# EAGLE schematic base1 (EAGLE 7.2.0)
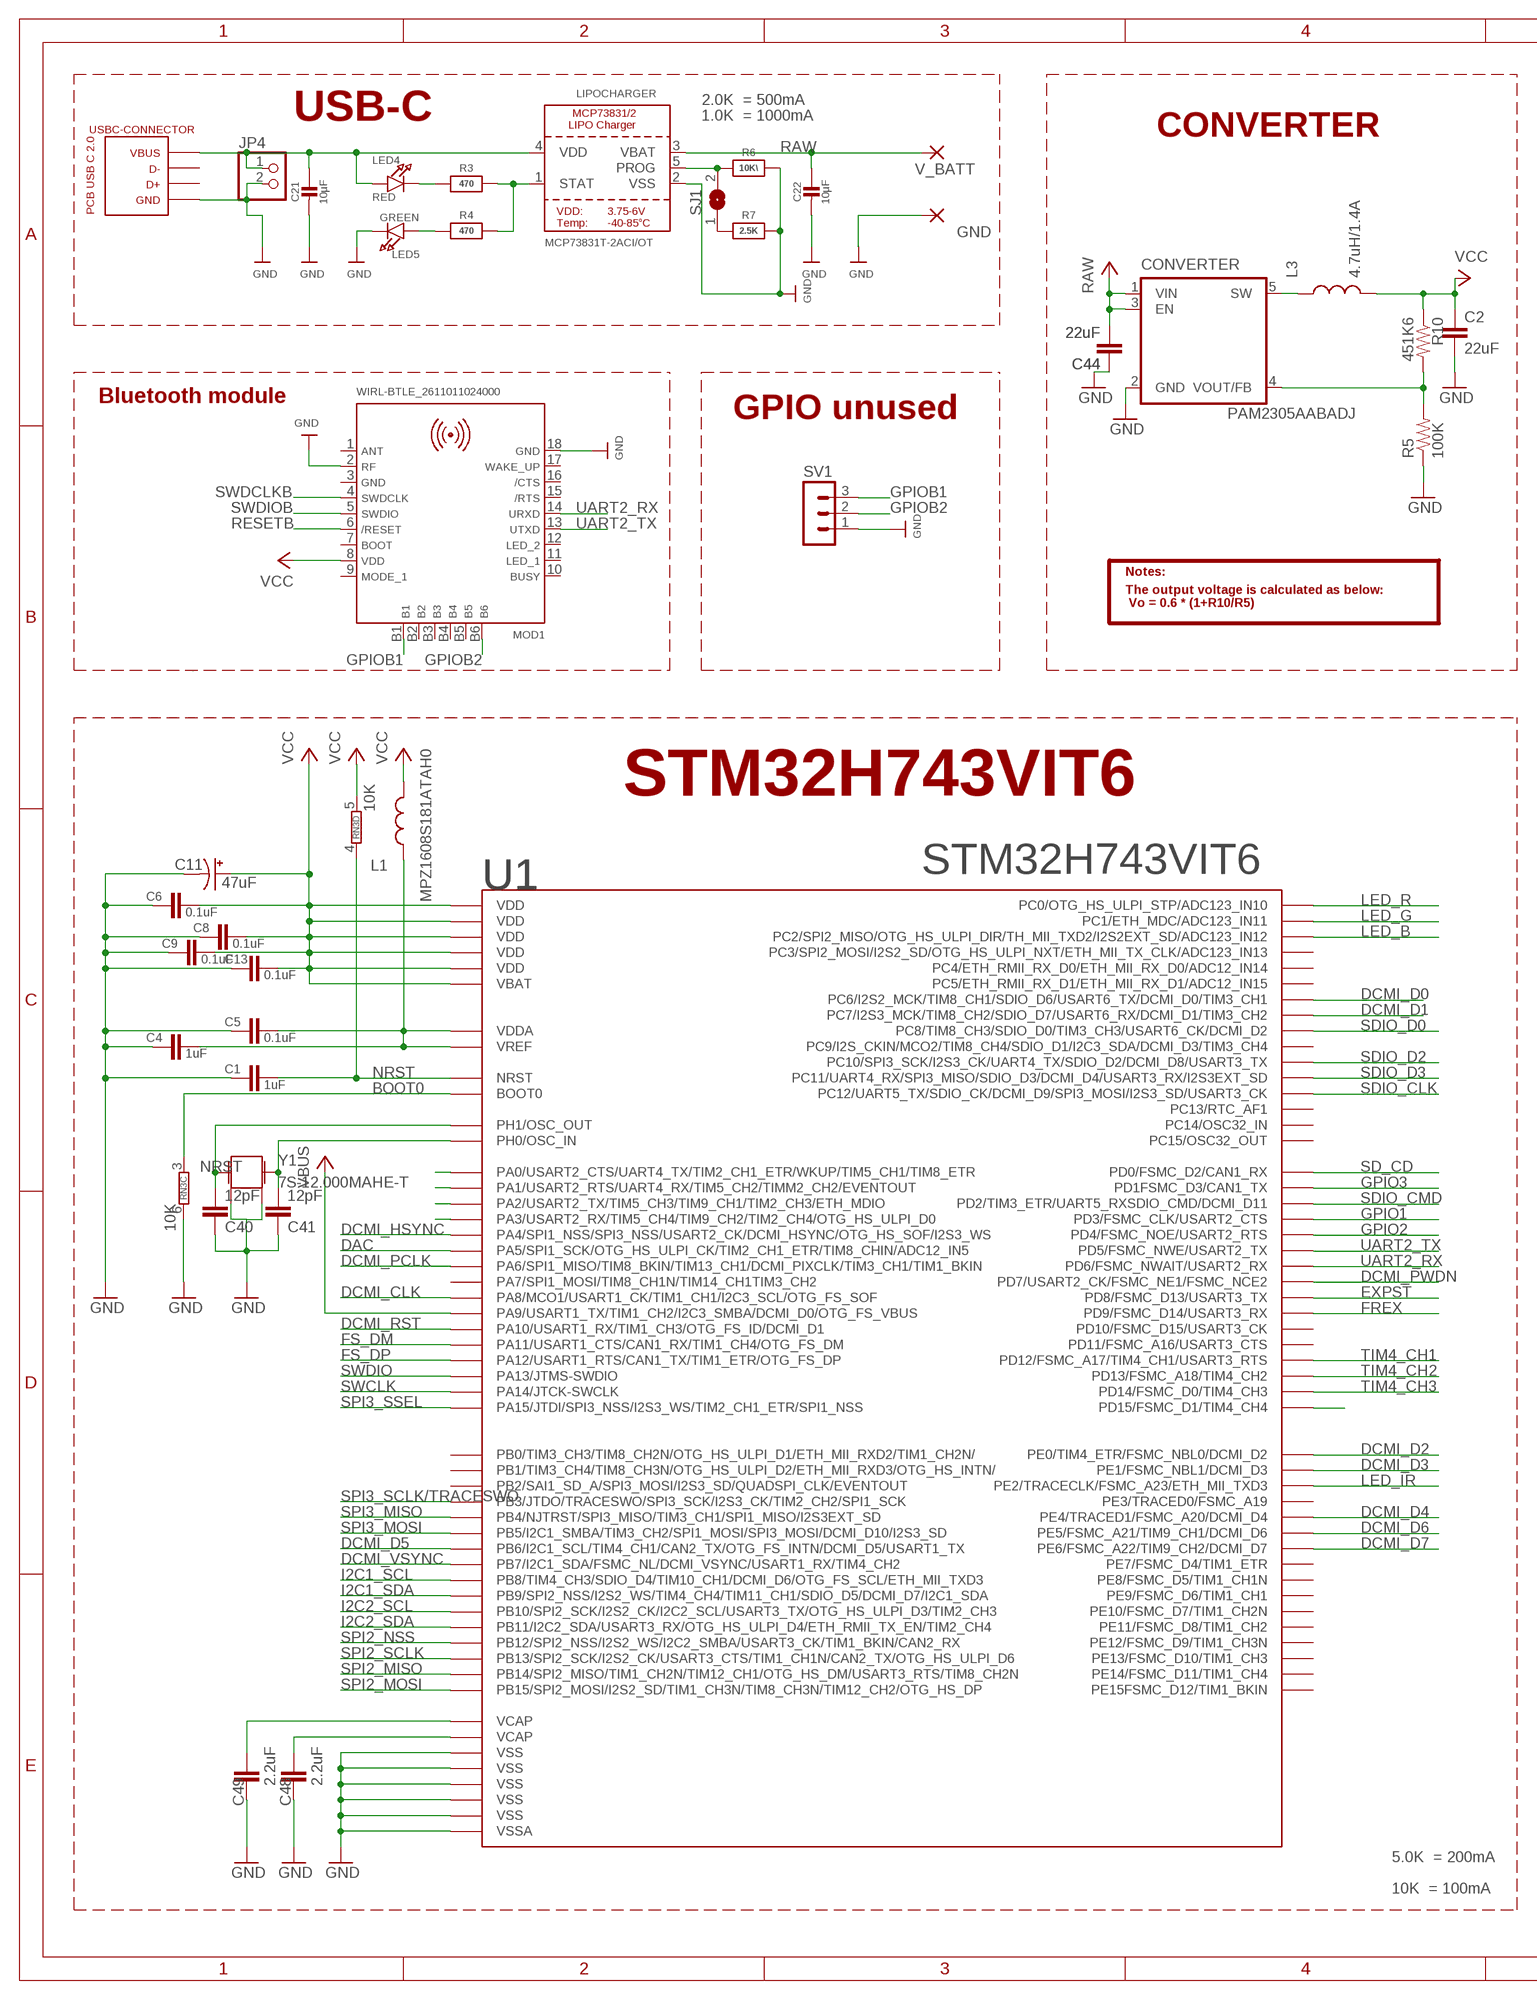
[diagram p0: schematic, sheet 1, part 1 of 2]
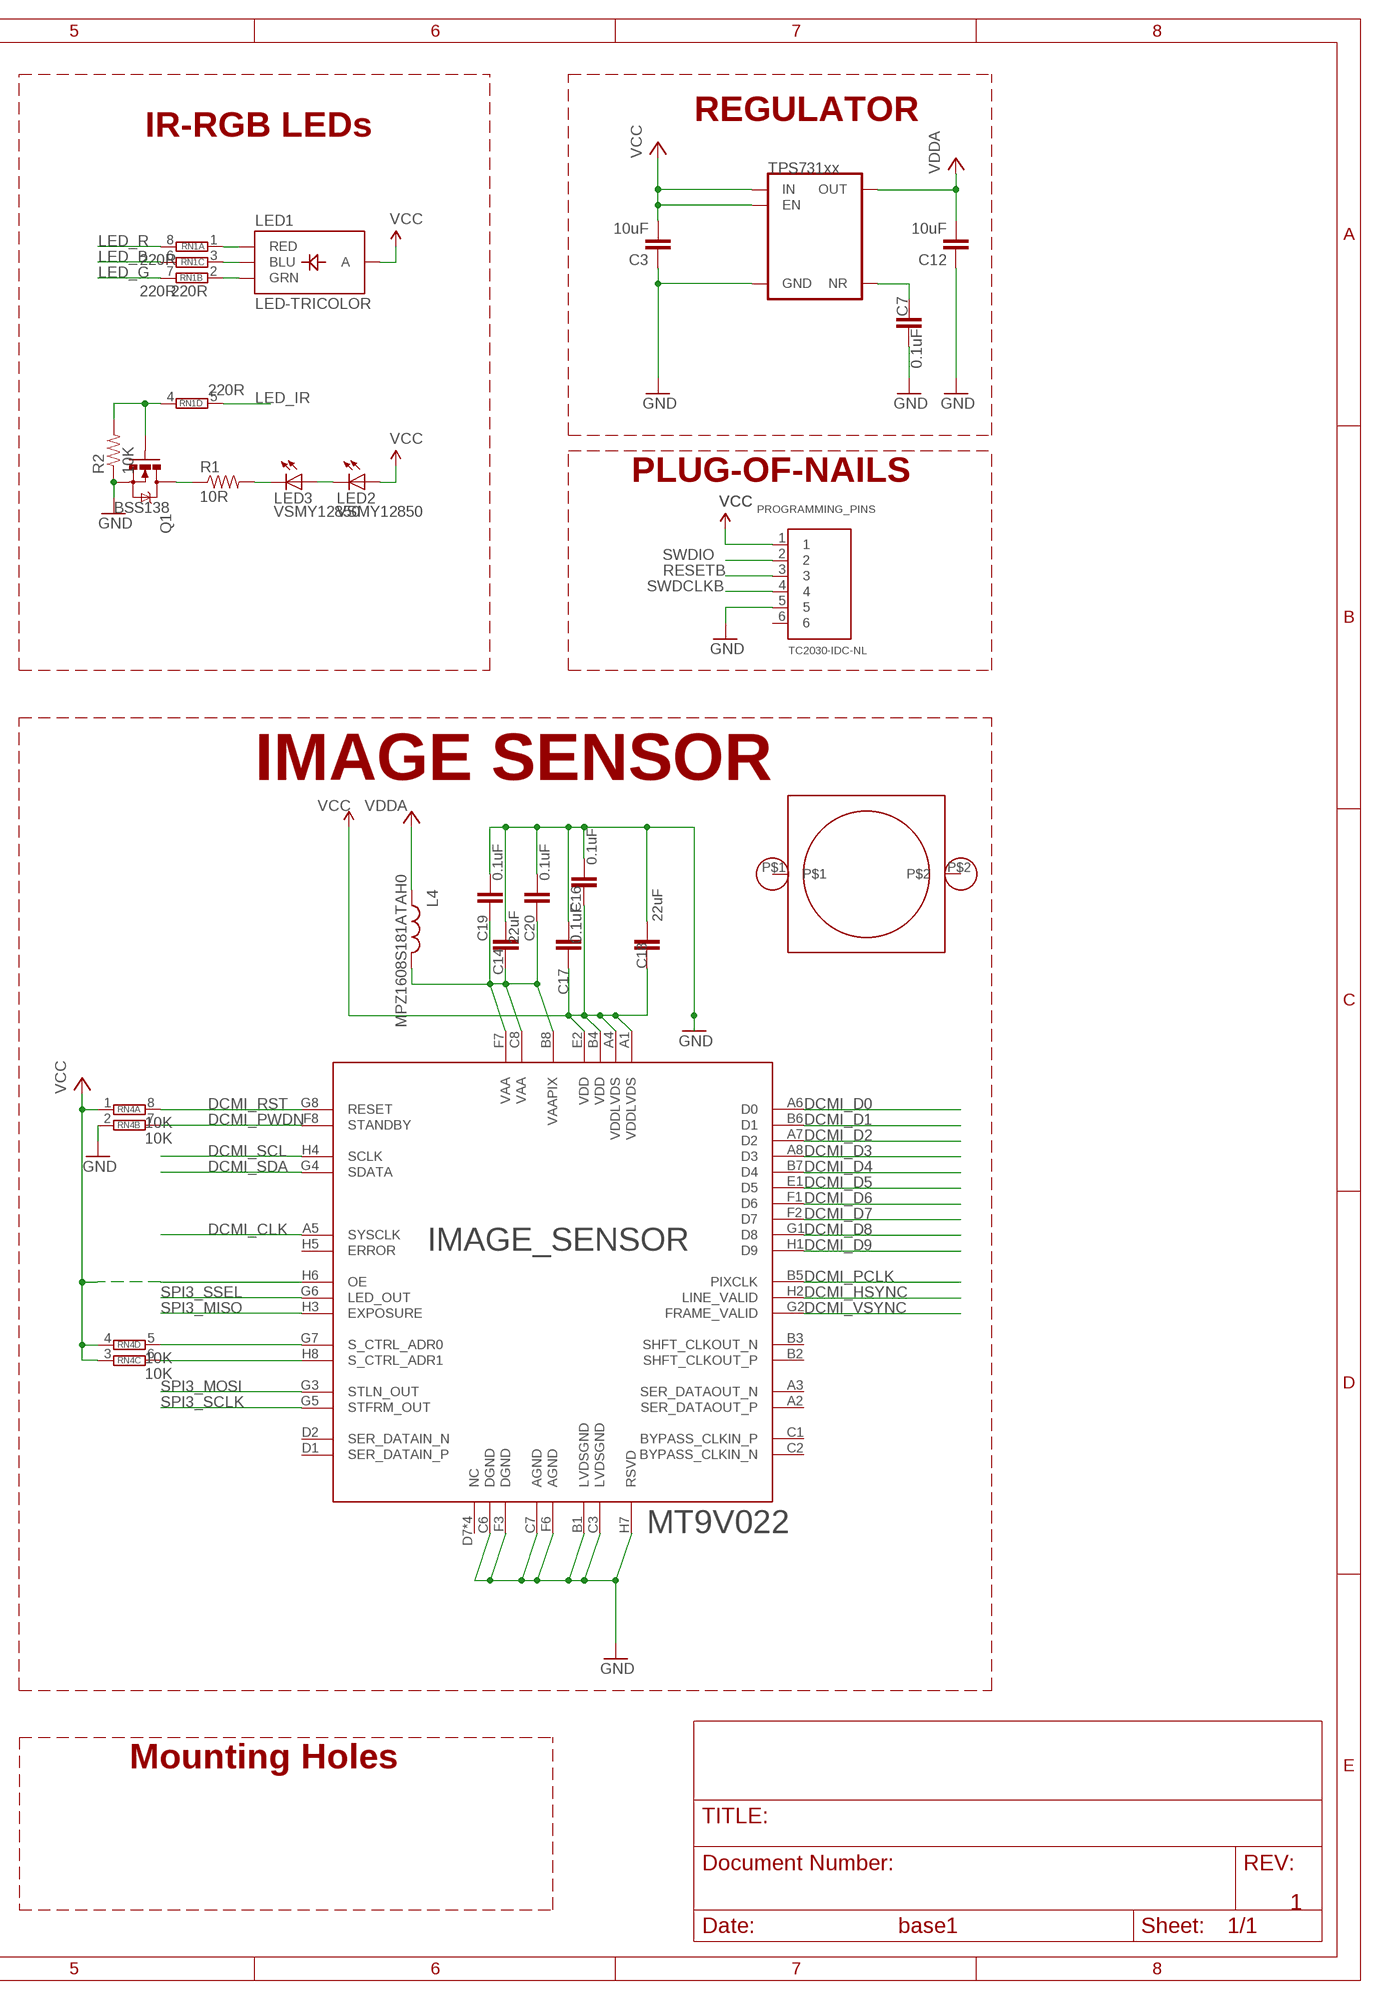
[diagram p1: schematic, sheet 1, part 2 of 2]

## Parts
C1  1uF  CAP0603-CAP  [0603-CAP]
C2  22uF  CAP0805  [0805]
C3  10uF  CAP0805  [0805]
C4  1uF  CAP0603-CAP  [0603-CAP]
C5  0.1uF  CAP0603-CAP  [0603-CAP]
C6  0.1uF  CAP0603-CAP  [0603-CAP]
C7  0.1uF  CAP0603-CAP  [0603-CAP]
C8  0.1uF  CAP0603-CAP  [0603-CAP]
C9  0.1uF  CAP0603-CAP  [0603-CAP]
C11  47uF  CAP_POL1206  [EIA3216]
C12  10uF  CAP0805  [0805]
C13  0.1uF  CAP0603-CAP  [0603-CAP]
C14  22uF  CAP0805  [0805]
C16  0.1uF  CAP0402-CAP  [0402-CAP]
C17  0.1uF  CAP0402-CAP  [0402-CAP]
C18  22uF  CAP0805  [0805]
C19  0.1uF  CAP0402-CAP  [0402-CAP]
C20  0.1uF  CAP0402-CAP  [0402-CAP]
C21  10µF  CAP_CERAMIC0805-NOOUTLINE  [0805-NO]
C22  10µF  CAP_CERAMIC0805-NOOUTLINE  [0805-NO]
C40  12pF  CAP0603-CAP  [0603-CAP]
C41  12pF  CAP0603-CAP  [0603-CAP]
C44  22uF  CAP0805  [0805]
C48  2.2uF  CAP0603-CAP  [0603-CAP]
C49  2.2uF  CAP0603-CAP  [0603-CAP]
CONVERTER  PAM2305AABADJ  PAM2305AAB330  [TSOT25]
GND  SMD2  [SMD1,27-2,54]
IMAGE_SENSOR  MT9V022  [IBGA52]
JP4  HEADER-1X2ROUND  [1X02_ROUND]
L1  MPZ1608S181ATAH0  INDUCTOR0603  [0603]
L3  4.7uH/1.4A  INDUCTOR1007  [1007]
L4  MPZ1608S181ATAH0  INDUCTOR0603  [0603]
LED1  LED-TRICOLOR  [LED-TRICOLOR-SMD-MF]
LED2  VSMY12850  LED1206  [LED-1206]
LED3  VSMY12850  LED1206  [LED-1206]
LED4  RED  LED0805_NOOUTLINE  [CHIPLED_0805_NOOUTLINE]
LED5  GREEN  LED0805_NOOUTLINE  [CHIPLED_0805_NOOUTLINE]
LIPOCHARGER  MCP73831T-2ACI/OT  MCP73831/2  [SOT23-5]
MOD1  WIRL-BTLE_2611011024000  [WE-FP-4+]
PROGRAMMING_PINS  TC2030-IDC-NL  [TAG_TC2030-IDC-NL]
Q1  BSS138  MOSFET-NCHANNELSMD  [SOT23-3]
R1  10R  RESISTOR0603-RES  [0603-RES]
R2  10K  RESISTOR0603-RES  [0603-RES]
R3  470  RESISTOR0805_NOOUTLINE  [0805-NO]
R4  470  RESISTOR0805_NOOUTLINE  [0805-NO]
R5  100K  RESISTOR0603-RES  [0603-RES]
R6  10K\  RESISTOR0805_NOOUTLINE  [0805-NO]
R7  2.5K  RESISTOR0805_NOOUTLINE  [0805-NO]
R10  451K6  RESISTOR0603-RES  [0603-RES]
REGULATOR  TPS731XX  [SOT23-5]
RN1  220R  4R-NEXBV8V  [EXBV8V]
RN3  10K  4R-NEXBV8V  [EXBV8V]
RN4  10K  4R-NEXBV8V  [EXBV8V]
SJ1  SOLDERJUMPER  [SOLDERJUMPER_ARROW_NOPASTE]
SV1  MA03-1  [MA03-1]
U1  STM32H743VIT6  STM32F746LQFP100  [LQFP100]
U$8  PLASTIC_CAMERA  [PLASTIC_CAMERA]
USBC-CONNECTOR  PCB_USB_C_2.0DS_2  [USB_TYPE_C_DS_2]
V_BATT  SMD2  [SMD1,27-2,54]
Y1  7S-12.000MAHE-T  CRYSTAL2.5X2.0  [CRYSTAL-2.5X2.0]

## Nets
BOOT0: RN3.3 U1.94(BOOT0)
DAC: U1.29(PA5/SPI1_SCK/OTG_HS_ULPI_CK/TIM2_CH1_ETR/TIM8_CHIN/ADC12_IN5)
DCMI_CLK: IMAGE_SENSOR.A5(SYSCLK) U1.67(PA8/MCO1/USART1_CK/TIM1_CH1/I2C3_SCL/OTG_FS_SOF)
DCMI_D0: IMAGE_SENSOR.A6(D0) U1.63(PC6/I2S2_MCK/TIM8_CH1/SDIO_D6/USART6_TX/DCMI_D0/TIM3_CH1)
DCMI_D1: IMAGE_SENSOR.B6(D1) U1.64(PC7/I2S3_MCK/TIM8_CH2/SDIO_D7/USART6_RX/DCMI_D1/TIM3_CH2)
DCMI_D2: IMAGE_SENSOR.A7(D2) U1.97(PE0/TIM4_ETR/FSMC_NBL0/DCMI_D2)
DCMI_D3: IMAGE_SENSOR.A8(D3) U1.98(PE1/FSMC_NBL1/DCMI_D3)
DCMI_D4: IMAGE_SENSOR.B7(D4) U1.3(PE4/TRACED1/FSMC_A20/DCMI_D4)
DCMI_D5: IMAGE_SENSOR.E1(D5) U1.92(PB6/I2C1_SCL/TIM4_CH1/CAN2_TX/OTG_FS_INTN/DCMI_D5/USART1_TX)
DCMI_D6: IMAGE_SENSOR.F1(D6) U1.4(PE5/FSMC_A21/TIM9_CH1/DCMI_D6)
DCMI_D7: IMAGE_SENSOR.F2(D7) U1.5(PE6/FSMC_A22/TIM9_CH2/DCMI_D7)
DCMI_D8: IMAGE_SENSOR.G1(D8)
DCMI_D9: IMAGE_SENSOR.H1(D9)
DCMI_HSYNC: IMAGE_SENSOR.H2(LINE_VALID) U1.28(PA4/SPI1_NSS/SPI3_NSS/USART2_CK/DCMI_HSYNC/OTG_HS_SOF/I2S3_WS)
DCMI_PCLK: IMAGE_SENSOR.B5(PIXCLK) U1.30(PA6/SPI1_MISO/TIM8_BKIN/TIM13_CH1/DCMI_PIXCLK/TIM3_CH1/TIM1_BKIN)
DCMI_PWDN: IMAGE_SENSOR.F8(STANDBY) RN4.7 U1.88(PD7/USART2_CK/FSMC_NE1/FSMC_NCE2)
DCMI_RST: IMAGE_SENSOR.G8(RESET) RN4.8 U1.69(PA10/USART1_RX/TIM1_CH3/OTG_FS_ID/DCMI_D1)
DCMI_SCL: IMAGE_SENSOR.H4(SCLK)
DCMI_SDA: IMAGE_SENSOR.G4(SDATA)
DCMI_VSYNC: IMAGE_SENSOR.G2(FRAME_VALID) U1.93(PB7/I2C1_SDA/FSMC_NL/DCMI_VSYNC/USART1_RX/TIM4_CH2)
EXPST: U1.55(PD8/FSMC_D13/USART3_TX)
FREX: U1.56(PD9/FSMC_D14/USART3_RX)
FS_DM: U1.70(PA11/USART1_CTS/CAN1_RX/TIM1_CH4/OTG_FS_DM)
FS_DP: U1.71(PA12/USART1_RTS/CAN1_TX/TIM1_ETR/OTG_FS_DP)
GND: C1.2 C2.2 C3.1 C4.2 C5.2 C6.2 C7.2 C8.2 C9.2 C11.C(-) C12.1 C13.2 C14.1 C16.2 C17.2 C18.1 C19.2 C20.2 C21.2 C22.2 C40.1 C41.1 C44.1 C48.2 C49.2 CONVERTER.2(GND) GND.1(P) IMAGE_SENSOR.B1(LVDSGND) IMAGE_SENSOR.C3(LVDSGND) IMAGE_SENSOR.C6(DGND) IMAGE_SENSOR.C7(AGND) IMAGE_SENSOR.F3(DGND) IMAGE_SENSOR.F6(AGND) IMAGE_SENSOR.H7(RSVD) JP4.2 LED5.C LIPOCHARGER.2(VSS) MOD1.2 MOD1.18 PROGRAMMING_PINS.5 Q1.2(S) R2.1 R5.1 R6.2 R7.2 REGULATOR.2(GND) RN3.6 RN4.2 SV1.1 U1.10(VSS) U1.19(VSSA) U1.26(VSS) U1.49(VSS) U1.74(VSS) U1.99(VSS) USBC-CONNECTOR.A4(VBUS) USBC-CONNECTOR.A9(VBUS) USBC-CONNECTOR.B4(VBUS) USBC-CONNECTOR.B9(VBUS) Y1.2 Y1.4
GPIO1: U1.84(PD3/FSMC_CLK/USART2_CTS)
GPIO2: U1.85(PD4/FSMC_NOE/USART2_RTS)
GPIO3: U1.82(PD1FSMC_D3/CAN1_TX)
GPIOB1: MOD1.B1 SV1.3
GPIOB2: MOD1.B6 SV1.2
I2C1_SCL: U1.95(PB8/TIM4_CH3/SDIO_D4/TIM10_CH1/DCMI_D6/OTG_FS_SCL/ETH_MII_TXD3)
I2C1_SDA: U1.96(PB9/SPI2_NSS/I2S2_WS/TIM4_CH4/TIM11_CH1/SDIO_D5/DCMI_D7/I2C1_SDA)
I2C2_SCL: U1.46(PB10/SPI2_SCK/I2S2_CK/I2C2_SCL/USART3_TX/OTG_HS_ULPI_D3/TIM2_CH3)
I2C2_SDA: U1.47(PB11/I2C2_SDA/USART3_RX/OTG_HS_ULPI_D4/ETH_RMII_TX_EN/TIM2_CH4)
LED_B: RN1.6 U1.17(PC2/SPI2_MISO/OTG_HS_ULPI_DIR/TH_MII_TXD2/I2S2EXT_SD/ADC123_IN12)
LED_G: RN1.7 U1.16(PC1/ETH_MDC/ADC123_IN11)
LED_IR: RN1.5 U1.1(PE2/TRACECLK/FSMC_A23/ETH_MII_TXD3)
LED_R: RN1.8 U1.15(PC0/OTG_HS_ULPI_STP/ADC123_IN10)
N$1: LED4.C R3.1
N$2: C40.2 U1.13(PH1/OSC_OUT) Y1.3
N$3: LIPOCHARGER.1(STAT) R3.2 R4.2
N$4: C41.2 U1.12(PH0/OSC_IN) Y1.1
N$5: Q1.1(G) R2.2 RN1.4
N$6: LED1.B(BLU) RN1.3
N$8: LED1.R(RED) RN1.1
N$9: LED1.G(GRN) RN1.2
N$10: LED3.C R1.2
N$11: C7.1 REGULATOR.4(NR)
N$12: C4.1 C5.1 L1.1 U1.20(VREF) U1.21(VDDA)
N$13: CONVERTER.4(VOUT/FB) R5.2 R10.2
N$14: Q1.3(D) R1.1
N$15: LIPOCHARGER.5(PROG) R6.1 SJ1.2
N$16: LED5.A R4.1
N$17: LED2.C LED3.A
N$18: R7.1 SJ1.1
N$19: IMAGE_SENSOR.G7(S_CTRL_ADR0) RN4.5
N$20: IMAGE_SENSOR.H8(S_CTRL_ADR1) RN4.6
N$30: U1.62(PD15/FSMC_D1/TIM4_CH4)
N$31: U1.22(PA0/USART2_CTS/UART4_TX/TIM2_CH1_ETR/WKUP/TIM5_CH1/TIM8_ETR)
N$32: U1.23(PA1/USART2_RTS/UART4_RX/TIM5_CH2/TIMM2_CH2/EVENTOUT)
N$33: U1.24(PA2/USART2_TX/TIM5_CH3/TIM9_CH1/TIM2_CH3/ETH_MDIO)
N$34: U1.25(PA3/USART2_RX/TIM5_CH4/TIM9_CH2/TIM2_CH4/OTG_HS_ULPI_D0)
NRST: C1.1 RN3.4 U1.14(NRST)
RAW: C22.1 C44.2 CONVERTER.1(VIN) CONVERTER.3(EN) LIPOCHARGER.3(VBAT) V_BATT.1(P)
RESETB: MOD1.6 PROGRAMMING_PINS.3
SD_CD: U1.81(PD0/FSMC_D2/CAN1_RX)
SDIO_CLK: U1.80(PC12/UART5_TX/SDIO_CK/DCMI_D9/SPI3_MOSI/I2S3_SD/USART3_CK)
SDIO_CMD: U1.83(PD2/TIM3_ETR/UART5_RXSDIO_CMD/DCMI_D11)
SDIO_D0: U1.65(PC8/TIM8_CH3/SDIO_D0/TIM3_CH3/USART6_CK/DCMI_D2)
SDIO_D2: U1.78(PC10/SPI3_SCK/I2S3_CK/UART4_TX/SDIO_D2/DCMI_D8/USART3_TX)
SDIO_D3: U1.79(PC11/UART4_RX/SPI3_MISO/SDIO_D3/DCMI_D4/USART3_RX/I2S3EXT_SD)
SPI2_MISO: U1.53(PB14/SPI2_MISO/TIM1_CH2N/TIM12_CH1/OTG_HS_DM/USART3_RTS/TIM8_CH2N)
SPI2_MOSI: U1.54(PB15/SPI2_MOSI/I2S2_SD/TIM1_CH3N/TIM8_CH3N/TIM12_CH2/OTG_HS_DP)
SPI2_NSS: U1.51(PB12/SPI2_NSS/I2S2_WS/I2C2_SMBA/USART3_CK/TIM1_BKIN/CAN2_RX)
SPI2_SCLK: U1.52(PB13/SPI2_SCK/I2S2_CK/USART3_CTS/TIM1_CH1N/CAN2_TX/OTG_HS_ULPI_D6)
SPI3_MISO: IMAGE_SENSOR.H3(EXPOSURE) U1.90(PB4/NJTRST/SPI3_MISO/TIM3_CH1/SPI1_MISO/I2S3EXT_SD)
SPI3_MOSI: IMAGE_SENSOR.G3(STLN_OUT) U1.91(PB5/I2C1_SMBA/TIM3_CH2/SPI1_MOSI/SPI3_MOSI/DCMI_D10/I2S3_SD)
SPI3_SCLK: IMAGE_SENSOR.G5(STFRM_OUT)
SPI3_SCLK/TRACESWO: U1.89(PB3/JTDO/TRACESWO/SPI3_SCK/I2S3_CK/TIM2_CH2/SPI1_SCK)
SPI3_SSEL: IMAGE_SENSOR.G6(LED_OUT) U1.77(PA15/JTDI/SPI3_NSS/I2S3_WS/TIM2_CH1_ETR/SPI1_NSS)
SW: CONVERTER.5(SW) L3.1
SWCLK: U1.76(PA14/JTCK-SWCLK)
SWDCLKB: MOD1.4 PROGRAMMING_PINS.4
SWDIO: PROGRAMMING_PINS.2 U1.72(PA13/JTMS-SWDIO)
SWDIOB: MOD1.5
TIM4_CH1: U1.59(PD12/FSMC_A17/TIM4_CH1/USART3_RTS)
TIM4_CH2: U1.60(PD13/FSMC_A18/TIM4_CH2)
TIM4_CH3: U1.61(PD14/FSMC_D0/TIM4_CH3)
UART2_RX: MOD1.14 U1.87(PD6/FSMC_NWAIT/USART2_RX)
UART2_TX: MOD1.13 U1.86(PD5/FSMC_NWE/USART2_TX)
VAA: C14.2 C19.1 C20.1 IMAGE_SENSOR.B8(VAAPIX) IMAGE_SENSOR.C8(VAA) IMAGE_SENSOR.F7(VAA) L4.2
VBAT: C2.1 C3.2 C6.1 C8.1 C9.1 C11.A(+) C13.1 C16.1 C17.1 C18.2 IMAGE_SENSOR.A1(VDDLVDS) IMAGE_SENSOR.A4(VDDLVDS) IMAGE_SENSOR.B4(VDD) IMAGE_SENSOR.E2(VDD) IMAGE_SENSOR.H6(OE) L1.2 L3.2 LED1.A LED2.A R10.1 REGULATOR.1(IN) REGULATOR.3(EN) RN3.5 RN4.1 RN4.3 RN4.4 U1.6(VBAT) U1.11(VDD) U1.27(VDD) U1.50(VDD) U1.75(VDD) U1.100(VDD) ; supply symbol labelled VCC
VBUS: U1.68(PA9/USART1_TX/TIM1_CH2/I2C3_SMBA/DCMI_D0/OTG_FS_VBUS)
VCAP1: C49.1 U1.48(VCAP)
VCAP2: C48.1 U1.73(VCAP)
VCC: MOD1.8 PROGRAMMING_PINS.1
VDD: C21.1 JP4.1 LED4.A LIPOCHARGER.4(VDD) USBC-CONNECTOR.A1(GND) USBC-CONNECTOR.A12(GND) USBC-CONNECTOR.B1(GND) USBC-CONNECTOR.B12(GND)
VDDA: C12.2 L4.1 REGULATOR.5(OUT)
Unconnected: IMAGE_SENSOR.A2(SER_DATAOUT_P) IMAGE_SENSOR.A3(SER_DATAOUT_N) IMAGE_SENSOR.B2(SHFT_CLKOUT_P) IMAGE_SENSOR.B3(SHFT_CLKOUT_N) IMAGE_SENSOR.C1(BYPASS_CLKIN_P) IMAGE_SENSOR.C2(BYPASS_CLKIN_N) IMAGE_SENSOR.D1(SER_DATAIN_P) IMAGE_SENSOR.D2(SER_DATAIN_N) IMAGE_SENSOR.D7(NC) IMAGE_SENSOR.D8(NC) IMAGE_SENSOR.E7(NC) IMAGE_SENSOR.E8(NC) IMAGE_SENSOR.H5(ERROR) MOD1.1 MOD1.3 MOD1.7 MOD1.9 MOD1.10 MOD1.11 MOD1.12 MOD1.15 MOD1.16 MOD1.17 MOD1.B2 MOD1.B3 MOD1.B4 MOD1.B5 PROGRAMMING_PINS.6 RN3.1 RN3.2 RN3.7 RN3.8 U1.2(PE3/TRACED0/FSMC_A19) U1.7(PC13/RTC_AF1) U1.8(PC14/OSC32_IN) U1.9(PC15/OSC32_OUT) U1.18(PC3/SPI2_MOSI/I2S2_SD/OTG_HS_ULPI_NXT/ETH_MII_TX_CLK/ADC123_IN13) U1.31(PA7/SPI1_MOSI/TIM8_CH1N/TIM14_CH1TIM3_CH2) U1.32(PC4/ETH_RMII_RX_D0/ETH_MII_RX_D0/ADC12_IN14) U1.33(PC5/ETH_RMII_RX_D1/ETH_MII_RX_D1/ADC12_IN15) U1.34(PB0/TIM3_CH3/TIM8_CH2N/OTG_HS_ULPI_D1/ETH_MII_RXD2/TIM1_CH2N/) U1.35(PB1/TIM3_CH4/TIM8_CH3N/OTG_HS_ULPI_D2/ETH_MII_RXD3/OTG_HS_INTN/) U1.36(PB2/SAI1_SD_A/SPI3_MOSI/I2S3_SD/QUADSPI_CLK/EVENTOUT) U1.37(PE7/FSMC_D4/TIM1_ETR) U1.38(PE8/FSMC_D5/TIM1_CH1N) U1.39(PE9/FSMC_D6/TIM1_CH1) U1.40(PE10/FSMC_D7/TIM1_CH2N) U1.41(PE11/FSMC_D8/TIM1_CH2) U1.42(PE12/FSMC_D9/TIM1_CH3N) U1.43(PE13/FSMC_D10/TIM1_CH3) U1.44(PE14/FSMC_D11/TIM1_CH4) U1.45(PE15FSMC_D12/TIM1_BKIN) U1.57(PD10/FSMC_D15/USART3_CK) U1.58(PD11/FSMC_A16/USART3_CTS) U1.66(PC9/I2S_CKIN/MCO2/TIM8_CH4/SDIO_D1/I2C3_SDA/DCMI_D3/TIM3_CH4) U$8.P$1 U$8.P$2 USBC-CONNECTOR.A6(D+) USBC-CONNECTOR.A7(D-) USBC-CONNECTOR.B6(D+) USBC-CONNECTOR.B7(D-)

## Notes on the sheet
- 2.0K  = 500mA
- USB-C | 1.0K  = 1000mA | REGULATOR
- CONVERTER | IR-RGB LEDs
- Bluetooth module
- GPIO unused
- PLUG-OF-NAILS
- Notes:
- The output voltage is calculated as below:
   Vo = 0.6 * (1+R10/R5)
- STM32H743VIT6 | IMAGE SENSOR
- Mounting Holes
- 5.0K  = 200mA
- 10K  = 100mA
- 1

## Library data of the parts
C1-C9 C12-C14 C16-C20 C40 C41 C44 C48 C49 = sfe:CAP: Capacitor Standard 0603 ceramic capacitor, and 0.1" leaded capacitor.
C11 = sfe:CAP_POL: Capacitor Polarized These are standard SMD and PTH capacitors. Normally 10uF, 47uF, and 100uF in electrolytic and tantalum varieties. Always verify the external diameter of the through hole cap, it varies with capacity, voltage, and manufacturer. The EIA devices should be standard.
C21 C22 = microbuilder:CAP_CERAMIC: Ceramic Capacitors For new designs, use the packages preceded by an '_' character since they are more reliable: The following footprints should be used on most boards: _0402 - Standard footprint for regular board layouts _0603 - Standard footprint for regular board layouts _0805 - Standard footprint for regular board layouts _1206 - Standard footprint for regular board layouts For extremely tight-pitch boards where space is at a premium, the following 'micro-pitch' footprints can be used (smaller pads, no silkscreen outline, etc.): _0402MP - Micro-pitch footprint for very dense/compact boards _0603MP - Micro-pitch footprint for very dense/compact boards _0805MP - Micro-pitch footprint for very dense/compact boards _1206MP - Micro-pitch footprint for very dense/compact boards
CONVERTER = regulators:PAM2305AAB330
GND V_BATT = wirepad:SMD2: SMD PAD
IMAGE_SENSOR = MT9V022:MT9V022
JP4 = microbuilder:HEADER-1X2: PIN HEADER
L1 L3 L4 = sfe:INDUCTOR: Inductors Basic Inductor/Choke - 0603 and 1206. Footprints are not proven and vary greatly between part numbers.
LED1 = sfe:LED-TRICOLOR: Tri-Color LED SMD Proven layout and schematic for triple color LED in SMD package - common anode. Spark Fun Electronics SKU : COM-07844
LED2 LED3 = sfe:LED: LEDs Standard schematic elements and footprints for 5mm, 3mm, 1206, and 0603 sized LEDs. 5mm - Spark Fun Electronics SKU : COM-00529 (and others)
LED4 LED5 = microbuilder:LED: LED 0603 - 0603 Surface Mount Package 2mA: Green LED - Low Power (3.9mcd, 2ma, 1.7Vf) - Digikey: 475-2709-2-ND Orange LED - Low Power (9.8mcd, 2ma, 1.8Vf) - Digikey: 475-1194-2-ND Red LED - Low Power (5mcd, 2ma, 1.8Vf) - Digikey: 475-1195-2-ND Yellow LED - Low Power (7mcd, 2ma, 1.8Vf) - Digikey: 475-1196-2-ND 5mA: Blue LED - Low Power (17mcd, 5ma, 2.9Vf) - Digikey: LNJ937W8CRACT-ND 0805 - 0805 Surface Mount Package 2mA: Red LED (8.8mcd, 2mA, 1.8Vf, Clear) - Low Power [Digikey: 475-2510-1-ND] Green LED (5mcd, 2mA, 1.8Vf, Clear) - Low Power [Digikey: 475-2730-1-ND] Yellow LED (11.3mcd, 2mA, 1.8Vf, Clear) - Low Power [Digikey: 475-2555-1-ND] 20mA: Red LED (104mcd, 20mA, Diffused) - LS R976 [Digikey: 475-1278-6-ND] Red LED (12mcd, 20mA, 2.0Vf, Clear) - APT2012EC [Digikey: 754-1128-1-ND] Green LED (15mcd, 20mA, 2.2Vf, Clear) - APT2012GC [Digikey: 754-1131-1-ND] Orange LED (160mcd, 20mA, 2.1Vf, Clear) - APT2012SECK [Digikey: 754-1130-1-ND] 1206 - 1206 Surface Mount Package Green LED (26mcd, 20mA, Diffused) - LG N971 [Digikey: 475-1407-6-ND] Red LED (15mcd, 20mA, Diffused) - LH N974 [Digikey: 475-1416-6-ND] Cree - Cree High-Power Surface Mount LEDs XPEBWT-L1-0000-00D50 - White 111lm 350mA 2.9Vf 6200K 110° XTEAWT-00-0000-00000LEE3 - White 114lm 350mA 2.85Vf 5000K 115° Everlight - Everlight 45-21 Series Surface Mount LEDs 45-21/QK2C-B2832AC2CB2/2T - Warm White 2000mcd 20mA 3.25Vf 3050K 120° 45-21/LK2C-B38452C4CB2/2T - Nuetral White 2000mcd 20mA 3.25Vf 4150K 120° 45-21/LK2C-B50634C6CB2/2T - Cold White 2200mcd 20mA 3.25Vf 5650K 120° PLCC2 Reverse Mount LS T77K-J1L2-1-0-2-R18-Z - Red 11.25mcd 2mA 1.8Vf 630nm 120° LO T77K-L1M2-24-Z - Orange 19.6mcd 2mA 1.8Vf 606nm 120° LY T77K-K2M1-26-Z - Yellow 15.7mcd 2mA 1.8Vf 587nm 120°
LIPOCHARGER = microbuilder:MCP73831/2: MCP73831/2 LIPO Charger VDD: 3.75 - 6V Temp -40 - 85°C Programmable Charge Rate: 15-500mA NOTE: STAT is a tri-state logic output on the MCP73831 and an open-drain output on the MCP73832. SOT23-5 with 4.2V output and tri-state logic on STAT = MCP73831T-2ACI/OT
MOD1 = WE_WIRL_Rev13.0:WIRL-BTLE_2611011024000: Proteus-III - Bluetooth® LE 5.1 Module WIRL-BTLE Bluetooth® LE 5.1 Module Details see: https://we-online.de/katalog/en/article/2611011024000/; HEIGHT: 2mm; MANUFACTURER: Würth Elektronik; NR: 2611011024000
PROGRAMMING_PINS = TC2030-IDC-NL:TC2030-IDC-NL: CABLE ADAPTER 6 POS Check availability <https://pricing.snapeda.com/parts/TC2030-IDC-NL/Tag-Connect/view-part?ref=eda>; AVAILABILITY: Not in stock; CHECK_PRICES: https://www.snapeda.com/parts/TC2030-IDC-NL/Tag-Connect/view-part/?ref=eda; DESCRIPTION: PLUG-OF-NAILS 6-PIN W/O LEGS 8; MF: Tag-Connect; MP: TC2030-IDC-NL; PACKAGE: None; PRICE: None; SNAPEDA_LINK: https://www.snapeda.com/parts/TC2030-IDC-NL/Tag-Connect/view-part/?ref=snap
Q1 = sfe:MOSFET-NCHANNEL
R1 R2 R5 R10 = sfe:RESISTOR: Resistor Basic schematic elements and footprints for 0603, 1206, and PTH resistors.
R3 R4 R6 R7 = microbuilder:RESISTOR: Resistors For new designs, use the packages preceded by an '_' character since they are more reliable: The following footprints should be used on most boards: _0402 - Standard footprint for regular board layouts _0603 - Standard footprint for regular board layouts _0805 - Standard footprint for regular board layouts _1206 - Standard footprint for regular board layouts For extremely tight-pitch boards where space is at a premium, the following 'micro-pitch' footprints can be used (smaller pads, no silkscreen outline, etc.): _0402MP - Micro-pitch footprint for very dense/compact boards _0603MP - Micro-pitch footprint for very dense/compact boards _0805MP - Micro-pitch footprint for very dense/compact boards _1206MP - Micro-pitch footprint for very dense/compact boards
REGULATOR = mux:TPS731XX
RN1 RN3 RN4 = resistor-dil:4R-N: Array Chip Resistor Source: RS Component / Phycomp; OC_FARNELL: unknown; OC_NEWARK: unknown
SJ1 = microbuilder:SOLDERJUMPER: SMD Solder JUMPER Solder the two pads together to create a connection, or remove the solder to break it. REFLOW - Use this footprint for solder paste and reflow ovens. WAVE - Use this footprint for hand-soldering (larger pads). CLOSED - Has a trace between the two pads to ensure it is closed by default. The trace needs to be cut to disable the jumper, and can be closed again by creating a solder bridge between the two pads.; BOM: EXCLUDE
SV1 = con-lstb:MA03-1: PIN HEADER; OC_FARNELL: unknown; OC_NEWARK: unknown
U1 = stm32:STM32F746
U$8 = camera_openmv:PLASTIC_CAMERA
USBC-CONNECTOR = USB_pcb_connectors:PCB_USB_C_2.0
Y1 = mux:CRYSTAL: Crystals Various standard crystals. Proven footprints. Spark Fun Electronics SKU : COM-00534